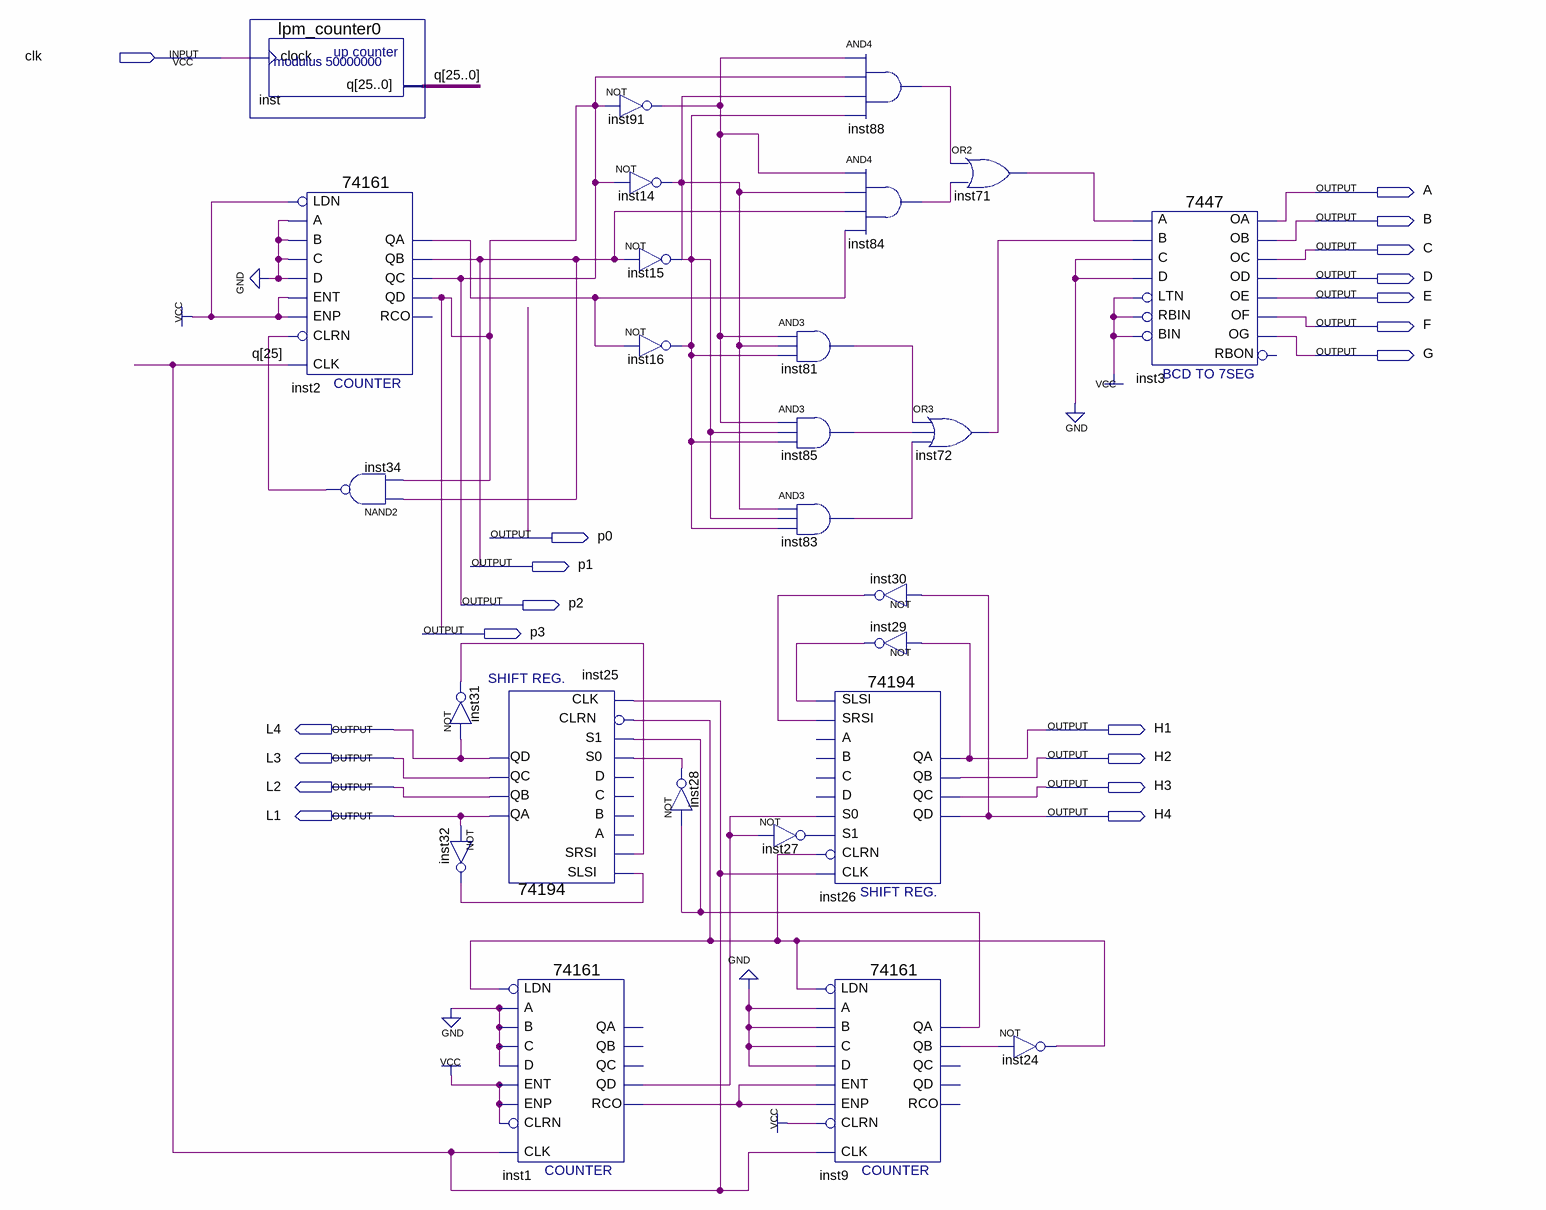
[diagram p0: schematic sheet]
// Quartus schematic iddisplay_1.bdf as structural Verilog: 26 symbols, 20 pins
module iddisplay_1 (
  input  clk,
  output A,
  output B,
  output C,
  output D,
  output E,
  output F,
  output G,
  output p0,
  output p1,
  output p2,
  output p3,
  output L4,
  output H1,
  output L3,
  output H2,
  output L2,
  output H3,
  output L1,
  output H4
);

  wire inst1_qd, inst1_rco, inst2_qa, inst9_qa, inst9_qb, inst14_out, inst24_out, inst27_out, inst28_out,
       inst29_out, inst30_out, inst31_out, inst32_out, inst34_out, inst71_out, inst72_out, inst81_out,
       inst83_out, inst84_out, inst85_out, inst88_out, inst91_out;
  wire [25:0] q;

  lpm_counter0 inst (.clock(clk), .q(q));
  \74161  inst2 (
    .CLRN(inst34_out), .CLK(q[25]), .ENP(1'b1), .LDN(1'b1), .A(1'b0), .D(1'b0), .ENT(1'b1), .B(1'b0),
    .C(1'b0), .QD(p2), .QC(p2), .QB(p1), .QA(inst2_qa));  // open: RCO
  nand inst34 (inst34_out, p1, p2);
  not inst31 (inst31_out, L4);
  not inst32 (inst32_out, L1);
  \74194  inst25 (
    .SLSI(inst32_out), .SRSI(inst31_out), .CLK(q[25]), .CLRN(inst24_out), .S1(inst9_qa), .S0(inst28_out),
    .QA(L1), .QB(L2), .QC(L3), .QD(L4));  // open: B, C, D, A
  \74161  inst1 (
    .CLRN(1'b1), .CLK(q[25]), .ENP(1'b1), .LDN(inst24_out), .A(1'b0), .D(1'b0), .ENT(1'b1), .B(1'b0),
    .C(1'b0), .QD(inst1_qd), .RCO(inst1_rco));  // open: QC, QB, QA
  not inst91 (inst91_out, p2);
  not inst14 (inst14_out, p2);
  not inst15 (inst14_out, p1);
  not inst16 (inst14_out, inst2_qa);
  not inst28 (inst28_out, inst9_qa);
  and inst81 (inst81_out, inst91_out, inst14_out, inst14_out);
  and inst85 (inst85_out, inst91_out, inst14_out, inst14_out);
  and inst83 (inst83_out, inst14_out, inst14_out, inst14_out);
  \74194  inst26 (
    .SLSI(inst29_out), .SRSI(inst30_out), .CLK(q[25]), .CLRN(inst24_out), .S1(inst27_out), .S0(inst1_qd),
    .QA(H1), .QB(H2), .QC(H3), .QD(H4));  // open: B, C, D, A
  not inst27 (inst27_out, inst1_qd);
  \74161  inst9 (
    .CLRN(1'b1), .CLK(q[25]), .ENP(inst1_rco), .LDN(inst24_out), .A(1'b0), .D(1'b0), .ENT(inst1_rco),
    .B(1'b0), .C(1'b0), .QB(inst9_qb), .QA(inst9_qa));  // open: QD, QC, RCO
  and inst88 (inst88_out, inst91_out, p2, inst14_out, inst14_out);
  and inst84 (inst84_out, inst91_out, inst14_out, p1, inst2_qa);
  not inst30 (inst30_out, H4);
  not inst29 (inst29_out, H1);
  or inst71 (inst71_out, inst88_out, inst84_out);
  or inst72 (inst72_out, inst81_out, inst85_out, inst83_out);
  not inst24 (inst24_out, inst9_qb);
  \7447  inst3 (
    .LTN(1'b1), .B(inst72_out), .C(1'b0), .D(1'b0), .RBIN(1'b1), .BIN(1'b1), .A(inst71_out), .OB(B), .OC(C),
    .OE(E), .OD(D), .OF(F), .OG(G), .OA(A));  // open: RBON

  assign p3 = p2;
endmodule
